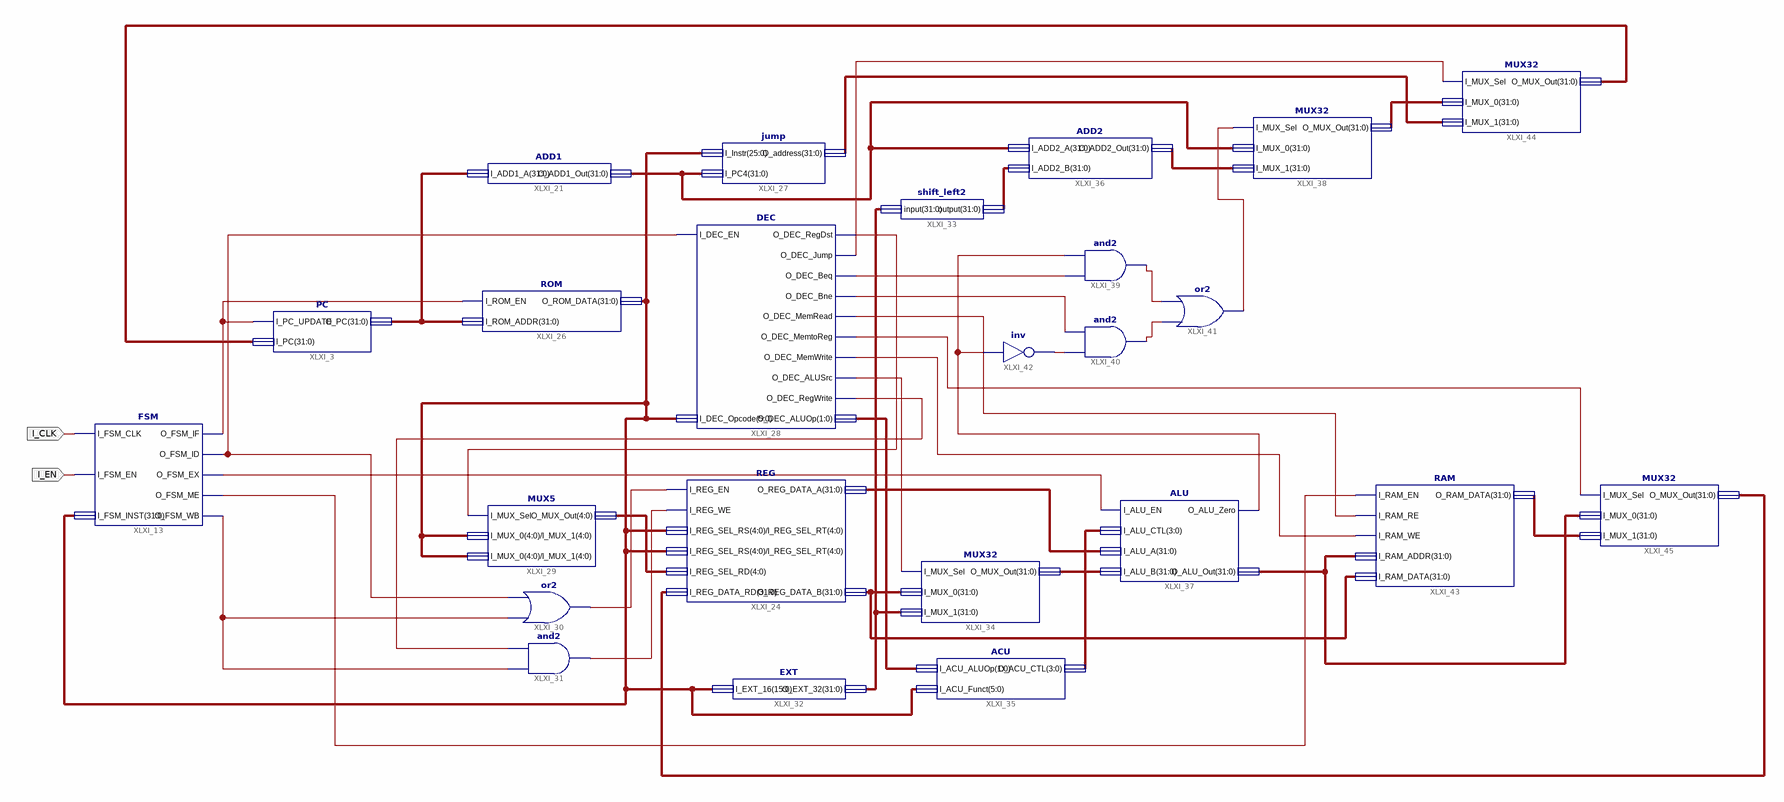
[diagram p0: schematic sheet 1]
// Xilinx ISE schematic CCSiMP32_Sch.sch (artix7) as structural Verilog: 24 symbols, 2 ports
module CCSiMP32_Sch (
  input  I_CLK,
  input  I_EN
);

  wire XLXN_11, XLXN_14, XLXN_32, XLXN_34, XLXN_35, XLXN_36, XLXN_37, XLXN_40, XLXN_46, XLXN_50, XLXN_51,
       XLXN_52, XLXN_53, XLXN_54, XLXN_55, XLXN_60, XLXN_61, XLXN_62, XLXN_63, XLXN_67, XLXN_70;
  wire [1:0] XLXN_41;
  wire [3:0] XLXN_48;
  wire [4:0] XLXN_33;
  wire [31:0] XLXN_1, XLXN_12, XLXN_29, XLXN_38, XLXN_39, XLXN_43, XLXN_44, XLXN_45, XLXN_49, XLXN_64,
       XLXN_65, XLXN_68, XLXN_69, XLXN_71, XLXN_72;

  FSM XLXI_13 (
    .I_FSM_CLK(I_CLK), .I_FSM_EN(I_EN), .I_FSM_INST(XLXN_29), .O_FSM_IF(XLXN_11), .O_FSM_ID(XLXN_14),
    .O_FSM_EX(XLXN_46), .O_FSM_ME(XLXN_61), .O_FSM_WB(XLXN_34));
  PC XLXI_3 (.I_PC_UPDATE(XLXN_11), .I_PC(XLXN_71), .O_PC(XLXN_1));
  ADD1 XLXI_21 (.I_ADD1_A(XLXN_1), .O_ADD1_Out(XLXN_12));
  REG XLXI_24 (
    .I_REG_EN(XLXN_35), .I_REG_WE(XLXN_37), .I_REG_SEL_RS(XLXN_29), .I_REG_SEL_RT(XLXN_29),
    .I_REG_SEL_RD(XLXN_33), .I_REG_DATA_RD(XLXN_72), .O_REG_DATA_A(XLXN_45), .O_REG_DATA_B(XLXN_39));
  ROM XLXI_26 (.I_ROM_EN(XLXN_11), .I_ROM_ADDR(XLXN_1), .O_ROM_DATA(XLXN_29));
  jump XLXI_27 (.I_Instr(XLXN_29), .I_PC4(XLXN_12), .O_address(XLXN_69));
  DEC XLXI_28 (
    .I_DEC_EN(XLXN_14), .I_DEC_Opcode(XLXN_29), .O_DEC_RegDst(XLXN_32), .O_DEC_Jump(XLXN_70),
    .O_DEC_Beq(XLXN_51), .O_DEC_Bne(XLXN_52), .O_DEC_MemRead(XLXN_62), .O_DEC_MemtoReg(XLXN_67),
    .O_DEC_MemWrite(XLXN_63), .O_DEC_ALUSrc(XLXN_40), .O_DEC_RegWrite(XLXN_36), .O_DEC_ALUOp(XLXN_41));
  MUX5 XLXI_29 (.I_MUX_Sel(XLXN_32), .I_MUX_0(XLXN_29), .I_MUX_1(XLXN_29), .O_MUX_Out(XLXN_33));
  or XLXI_30 (XLXN_35, XLXN_34, XLXN_14);
  and XLXI_31 (XLXN_37, XLXN_34, XLXN_36);
  EXT XLXI_32 (.I_EXT_16(XLXN_29), .O_EXT_32(XLXN_38));
  shift_left2 XLXI_33 (.\input (XLXN_38), .\output (XLXN_43));
  MUX32 XLXI_34 (.I_MUX_Sel(XLXN_40), .I_MUX_0(XLXN_39), .I_MUX_1(XLXN_38), .O_MUX_Out(XLXN_44));
  ACU XLXI_35 (.I_ACU_ALUOp(XLXN_41), .I_ACU_Funct(XLXN_29), .O_ACU_CTL(XLXN_48));
  ADD2 XLXI_36 (.I_ADD2_A(XLXN_12), .I_ADD2_B(XLXN_43), .O_ADD2_Out(XLXN_49));
  ALU XLXI_37 (
    .I_ALU_EN(XLXN_46), .I_ALU_CTL(XLXN_48), .I_ALU_A(XLXN_45), .I_ALU_B(XLXN_44), .O_ALU_Zero(XLXN_53),
    .O_ALU_Out(XLXN_64));
  MUX32 XLXI_38 (.I_MUX_Sel(XLXN_60), .I_MUX_0(XLXN_12), .I_MUX_1(XLXN_49), .O_MUX_Out(XLXN_68));
  and XLXI_39 (XLXN_54, XLXN_51, XLXN_53);
  and XLXI_40 (XLXN_55, XLXN_50, XLXN_52);
  or XLXI_41 (XLXN_60, XLXN_55, XLXN_54);
  not XLXI_42 (XLXN_50, XLXN_53);
  RAM XLXI_43 (
    .I_RAM_EN(XLXN_61), .I_RAM_RE(XLXN_62), .I_RAM_WE(XLXN_63), .I_RAM_ADDR(XLXN_64), .I_RAM_DATA(XLXN_39),
    .O_RAM_DATA(XLXN_65));
  MUX32 XLXI_44 (.I_MUX_Sel(XLXN_70), .I_MUX_0(XLXN_68), .I_MUX_1(XLXN_69), .O_MUX_Out(XLXN_71));
  MUX32 XLXI_45 (.I_MUX_Sel(XLXN_67), .I_MUX_0(XLXN_64), .I_MUX_1(XLXN_65), .O_MUX_Out(XLXN_72));
endmodule
